# Altium project LCD_Dev_PCB_Project.PrjPcb
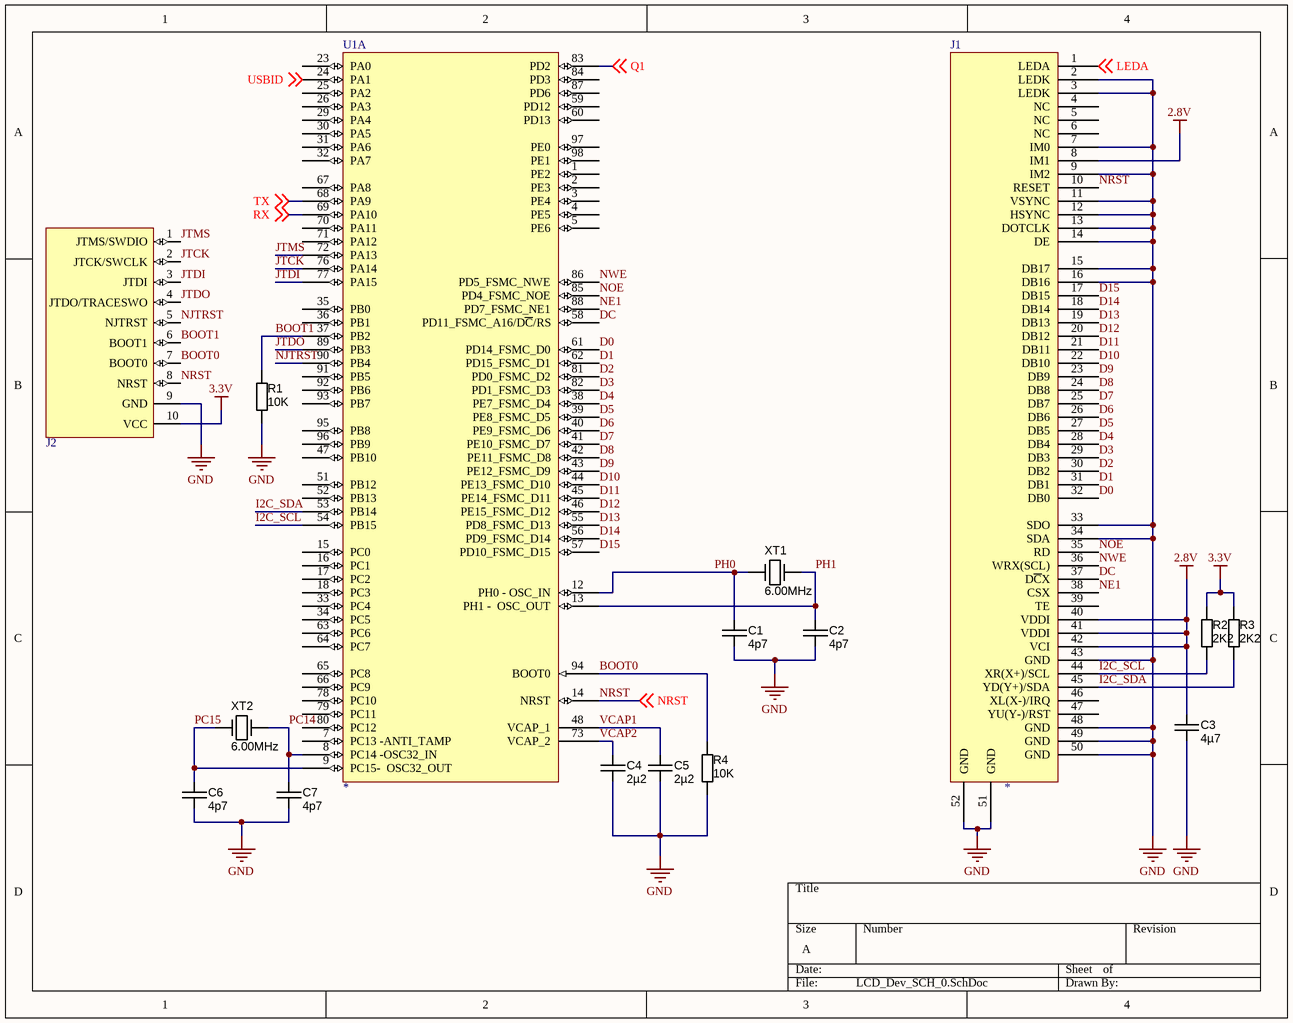
[diagram p0: LCD_Dev_SCH_0.SchDoc]
2 sheets, 60 parts. Net scope: global (net labels, ports and power ports of the same name join across sheets).
Board files: LCD_Dev_PCB.PcbDoc, LCD_Dev_PCB1.PcbDoc
Sheets:
  LCD_Dev_SCH_0.SchDoc
  LCD_Dev_SCH_1.SchDoc

## Sheet LCD_Dev_SCH_0.SchDoc
size A

### Parts
C1  value 4p7  [CAPC1608X90N]  (hidden comment: approved sub OK)
C2  value 4p7  [CAPC1608X90N]  (hidden comment: approved sub OK)
C3  value 4µ7  [CAPC2012X135N]  (hidden comment: approved sub OK)
C4  value 2µ2  [CAPC2012X135N]  (hidden comment: approved sub OK)
C5  value 2µ2  [CAPC2012X135N]  (hidden comment: approved sub OK)
C6  value 4p7  [CAPC1608X90N]  (hidden comment: approved sub OK)
C7  value 4p7  [CAPC1608X90N]  (hidden comment: approved sub OK)
J1  *  [ER-CON50HT-1]
J2  *  [SWJ-DP connector]  (value not drawn)
R1  value 10K  [RESC1608X55N]  (hidden comment: Thick Film)
R2  value 2K2  [RESC1608X55N]  (hidden comment: Thick Film)
R3  value 2K2  [RESC1608X55N]  (hidden comment: Thick Film)
R4  value 10K  [RESC1608X55N]  (hidden comment: Thick Film)
U1  *  [LQFP100_STM32F4]  (part A of 2)
XT1  6.00MHz  [CRYSTAL_HC49-US-SM]
XT2  6.00MHz  [CRYSTAL_HC49-US-SM]

### Nets
2.8V: C3.1 J1.8(IM1) J1.40(VDDI) J1.41(VDDI) J1.42(VCI)
3.3V: J2.10(VCC) R2.1 R3.1
GND: C1.2 C2.2 C3.2 C4.2 C5.2 C6.2 C7.2 J1.2(LEDK) J1.3(LEDK) J1.7(IM0) J1.9(IM2) J1.11(VSYNC) J1.12(HSYNC) J1.13(DOTCLK) J1.14(DE) J1.15(DB17) J1.16(DB16) J1.33(SDO) J1.34(SDA) J1.43(GND) J1.48(GND) J1.49(GND) J1.50(GND) J1.51(GND) J1.52(GND) J2.9(GND) R1.2 R4.2
BOOT0: J2.7(BOOT0) R4.1 U1.94(BOOT0)
BOOT1: J2.6(BOOT1) R1.1 U1.37(PB2)
D0: J1.32(DB0) U1.61(PD14_FSMC_D0)
D1: J1.31(DB1) U1.62(PD15_FSMC_D1)
D2: J1.30(DB2) U1.81(PD0_FSMC_D2)
D3: J1.29(DB3) U1.82(PD1_FSMC_D3)
D4: J1.28(DB4) U1.38(PE7_FSMC_D4)
D5: J1.27(DB5) U1.39(PE8_FSMC_D5)
D6: J1.26(DB6) U1.40(PE9_FSMC_D6)
D7: J1.25(DB7) U1.41(PE10_FSMC_D7)
D8: J1.24(DB8) U1.42(PE11_FSMC_D8)
D9: J1.23(DB9) U1.43(PE12_FSMC_D9)
D10: J1.22(DB10) U1.44(PE13_FSMC_D10)
D11: J1.21(DB11) U1.45(PE14_FSMC_D11)
D12: J1.20(DB12) U1.46(PE15_FSMC_D12)
D13: J1.19(DB13) U1.55(PD8_FSMC_D13)
D14: J1.18(DB14) U1.56(PD9_FSMC_D14)
D15: J1.17(DB15) U1.57(PD10_FSMC_D15)
DC: J1.37(D~{C}X) U1.58(PD11_FSMC_A16/D~{C}/RS)
I2C_SCL: J1.44(XR(X+)/SCL) R2.2 U1.54(PB15)
I2C_SDA: J1.45(YD(Y+)/SDA) R3.2 U1.53(PB14)
JTCK: J2.2(JTCK/SWCLK) U1.76(PA14)
JTDI: J2.3(JTDI) U1.77(PA15)
JTDO: J2.4(JTDO/TRACESWO) U1.89(PB3)
JTMS: J2.1(JTMS/SWDIO) U1.72(PA13)
LEDA: J1.1(LEDA) ; off-sheet LEDA
NE1: J1.38(CSX) U1.88(PD7_FSMC_NE1)
NJTRST: J2.5(NJTRST) U1.90(PB4)
NOE: J1.35(RD) U1.85(PD4_FSMC_NOE)
NRST: J1.10(RESET) J2.8(NRST) U1.14(NRST) ; off-sheet NRST
NWE: J1.36(WRX(SCL)) U1.86(PD5_FSMC_NWE)
PC14: C7.1 U1.8(PC14_-OSC32_IN) XT2.2(OUT)
PC15: C6.1 U1.9(PC15-__OSC32_OUT) XT2.1(IN)
PH0: C1.1 U1.12(PH0_-_OSC_IN) XT1.1(IN)
PH1: C2.1 U1.13(PH1_-__OSC_OUT) XT1.2(OUT)
Q1: U1.83(PD2) ; off-sheet Q1
RX: U1.69(PA10) ; off-sheet RX
TX: U1.68(PA9) ; off-sheet TX
USBID: U1.24(PA1) ; off-sheet USBID
VCAP1: C5.1 U1.48(VCAP_1)
VCAP2: C4.1 U1.73(VCAP_2)

Not connected (* = marked no-connect by the designer): J1 4(NC) 5(NC) 6(NC) 39(TE) 46(XL(X-)/IRQ) 47(YU(Y-)/RST); U1 1(PE2) 2(PE3) 3(PE4) 4(PE5) 5(PE6) 7(PC13_-ANTI_TAMP) 15(PC0) 16(PC1) 17(PC2) 18(PC3) 23(PA0) 25(PA2) 26(PA3) 29(PA4) 30(PA5) 31(PA6) 32(PA7) 33(PC4) 34(PC5) 35(PB0) 36(PB1) 47(PB10) 51(PB12) 52(PB13) 59(PD12) 60(PD13) 63(PC6) 64(PC7) 65(PC8) 66(PC9) 67(PA8) 70(PA11) 71(PA12) 78(PC10) 79(PC11) 80(PC12) 84(PD3) 87(PD6) 91(PB5) 92(PB6) 93(PB7) 95(PB8) 96(PB9) 97(PE0) 98(PE1)

### Library data of the parts
C1 C2 C6 C7 = CAPC_4p7_100V_0603: Capacitor SMD Cer 4.7pF ±0.25pF 100V NP0 0603; Manufacturer 1: AVX Corporation; Manufacturer Part Number 1: 06031A4R7CAT2A; Ratings: 100V; NP0; SCDType: source*; Tolerance: ±0.25pF; Operating Temperature: -55°C ~ 125°C; Package / Case: 0603 (1608 metric); Supplier 1: Digi-Key; Supplier Part Number 1: 478-4992-1-ND
C3 = CAPC_4u7_0805: Capacitor SMD Cer 4.7uF 10% 16V X5R 0805; Manufacturer 1: Taiyo Yuden; Manufacturer Part Number 1: EMK212BJ475KG-T; Ratings: 16V; X5R; Material: ceramic; SCDType: spec; Package / Case: 0805 (2012 Metric); Tolerance: ±10%; Supplier 1: Digi-Key; Supplier Part Number 1: 587-1294-1-ND; Operating Temperature: -55°C ~ 85°C; Size / Dimension: 0.079" L x 0.049" W (2.00mm x 1.25mm); Thickness (Max): 0.053" (1.35mm); ComponentLink1URL: http://www.yuden.co.jp/productdata/catalog/en/mlcc01_e.pdf; ComponentLink1Description: http://www.yuden.co.jp/productdata/catalog/en/mlcc01_e.pdf; Supplier 2: Digi-Key; Supplier Part Number 2: 1276-1065-1-ND; Manufacturer 2: Samsung Electro-Mechanics America, Inc; Manufacturer Part Number 2: CL21A475KOFNNNE; RoHS 2: RoHS Compliant; ComponentLink2URL: http://www.samsungsem.com/servlet/FileDownload?type=spec&file=CL21A475KOFNNNE.pdf; ComponentLink2Description: http://www.samsungsem.com/servlet/FileDownload?type=spec&file=CL21A475KOFNNNE.pdf; Supplier 3: Digi-Key; Supplier Part Number 3: 399-8101-1-ND; Manufacturer 3: Kemet; Manufacturer Part Number 3: C0805C475K4PACTU; RoHS 3: RoHS Compliant; ComponentLink3URL: http://capacitoredge.kemet.com/capedge2/DataSheet?pn=C0805C475K4PACTU; ComponentLink3Description: http://capacitoredge.kemet.com/capedge2/DataSheet?pn=C0805C475K4PACTU; Supplier 4: Digi-Key; Supplier Part Number 4: 490-7215-1-ND; Manufacturer 4: Murata Electronics North America; Manufacturer Part Number 4: GRM21BR61C475MA88L; RoHS 4: RoHS Compliant; ComponentLink4URL: http://psearch.murata.com/capacitor/product/GRM21BR61C475MA88#.pdf; ComponentLink4Description: http://psearch.murata.com/capacitor/product/GRM21BR61C475MA88#.pdf; Supplier 5: Digi-Key; Supplier Part Number 5: 445-7640-1-ND; Manufacturer 5: TDK Corporation; Manufacturer Part Number 5: C2012X5R1C475K125AC; RoHS 5: RoHS Compliant; ComponentLink5URL: http://product.tdk.com/capacitor/mlcc/en/documents/mlcc_commercial_general_en.pdf; ComponentLink5Description: http://product.tdk.com/capacitor/mlcc/en/documents/mlcc_commercial_general_en.pdf; RoHS 1: RoHS Compliant
C4 C5 = CAPC_2u2_0805: Capacitor SMD Cer 2.2uF 10% 16V X7R 0805; Manufacturer 1: Kemet; Manufacturer Part Number 1: C0805C225K4RACTU; Ratings: 16V; X7R; SCDType: undef; Package / Case: 0805 (2012 metric); Tolerance: ±10%; Supplier 1: Digi-Key; Supplier Part Number 1: 399-3523-1-ND
J1 = LCD-Port: 3.5”TFT LCD Display Port (i80/6800/FSMC etc)
J2 = SWJ-Debug Port: 10 pin Serial Wire JTAG Debug Port
R1 R4 = RES_10K_0603_5%: Resistor SMD chip 10k Ohm 0.1W 5% 0603; Manufacturer 1: Yageo; Manufacturer Part Number 1: RC0603JR-0710KL; Ratings: 1/10 W; SCDType: spec; Package / Case: 0603 (1608 metric); Tolerance: ±5%; Manufacturer 2: Vishay Dale; Manufacturer Part Number 2: CRCW060310K0JNEA; Supplier 1: Digi-Key; Supplier Part Number 1: 311-10KGRCT-ND; ComponentLink1URL: http://www.yageo.com/documents/recent/PYu-RC0603_51_RoHS_L_4.pdf; ComponentLink1Description: http://www.yageo.com/documents/recent/PYu-RC0603_51_RoHS_L_4.pdf; Supplier 2: Digi-Key; Supplier Part Number 2: 541-10KGCT-ND; ComponentLink2URL: http://www.vishay.com/doc?20035; ComponentLink2Description: http://www.vishay.com/doc?20035; Material: Thick Film
R2 R3 = RES_2K2_0603_5%: Resistor SMD chip 2.2k Ohm 0.1W 5% 0603; Manufacturer 1: Yageo; Manufacturer Part Number 1: RC0603JR-072K2L; Ratings: 1/10 W; SCDType: spec; Temperature Coefficient: ±100ppm/°C; Package / Case: 0603 (1608 metric); Tolerance: ±5%; Material: Thick Film; Manufacturer 2: Samsung Electro-Mechanics America, Inc; Manufacturer Part Number 2: RC1608J222CS; Supplier 1: Digi-Key; Supplier Part Number 1: 311-2.2KGRDKR-ND; ComponentLink1URL: http://www.yageo.com/documents/recent/PYu-RC0603_51_RoHS_L_4.pdf; ComponentLink1Description: http://www.yageo.com/documents/recent/PYu-RC0603_51_RoHS_L_4.pdf; Supplier 2: Digi-Key; Supplier Part Number 2: 1276-5070-6-ND; ComponentLink2URL: http://www.samsungsem.com/servlet/FileDownload?filename=productcatalog/pdf/Chip_Resistor.pdf; ComponentLink2Description: http://www.samsungsem.com/servlet/FileDownload?filename=productcatalog/pdf/Chip_Resistor.pdf; RoHS 1: RoHS Compliant; RoHS 2: RoHS Compliant; Supplier 3: Digi-Key; Supplier Part Number 3: RMCF0603JT2K20DKR-ND; Manufacturer 3: Stackpole Electronics Inc; Manufacturer Part Number 3: RMCF0603JT2K20; RoHS 3: RoHS Compliant; ComponentLink3URL: http://www.seielect.com/Catalog/SEI-RMCF_RMCP.pdf; ComponentLink3Description: http://www.seielect.com/Catalog/SEI-RMCF_RMCP.pdf; Supplier 4: Digi-Key; Supplier Part Number 4: RHM2.2KCGDKR-ND; Manufacturer 4: Rohm Semiconductor; Manufacturer Part Number 4: MCR03ERTJ222; RoHS 4: RoHS Compliant; ComponentLink4URL: http://rohmfs.rohm.com/en/products/databook/datasheet/passive/resistor/chip_resistor/mcr_g.pdf; ComponentLink4Description: http://rohmfs.rohm.com/en/products/databook/datasheet/passive/resistor/chip_resistor/mcr_g.pdf; Supplier 5: Digi-Key; Supplier Part Number 5: P2.2KGDKR-ND; Manufacturer 5: Panasonic Electronic Components; Manufacturer Part Number 5: ERJ-3GEYJ222V; RoHS 5: RoHS Compliant; ComponentLink5URL: http://industrial.panasonic.com/www-cgi/jvcr13pz.cgi?E+PZ+3+AOA0001+ERJ3GEYJ222V+7+WW; ComponentLink5Description: http://industrial.panasonic.com/www-cgi/jvcr13pz.cgi?E+PZ+3+AOA0001+ERJ3GEYJ222V+7+WW
U1 = STM32F413xH: STM32F413VHT symbol for FSMC application with designated FSMC relevant pins
XT1 XT2 = Crystal_6MHz_HC49/US: Resonator Ceramic 6.00 MHz 30ppm; Manufacturer 1: CTS-Frequency Controls; Manufacturer Part Number 1: ATS060BSM-1; Frequency: 6MHz; Frequency Stability: ±50ppm; Load Capacitance: 18pF; Operating Mode: Fundamental; Parameter Name: 0.169" (4.30mm); SCDType: spec; Package / Case: HC49/US-SM; Ratings: 6.00 MHz; Supplier 1: Digi-Key; Supplier Part Number 1: CTX882CT-ND; Type: MHz Crystal; Frequency Tolerance: ±30ppm; Operating Temperature: -20°C ~ 70°C; Mounting Type: Surface Mount; Size / Dimension: 0.437" L x 0.190" W (11.10mm x 4.83mm); ComponentLink1URL: http://www.ctscorp.com/components/Datasheets/008-0309-0.pdf; ComponentLink1Description: http://www.ctscorp.com/components/Datasheets/008-0309-0.pdf

## Sheet LCD_Dev_SCH_1.SchDoc
size A
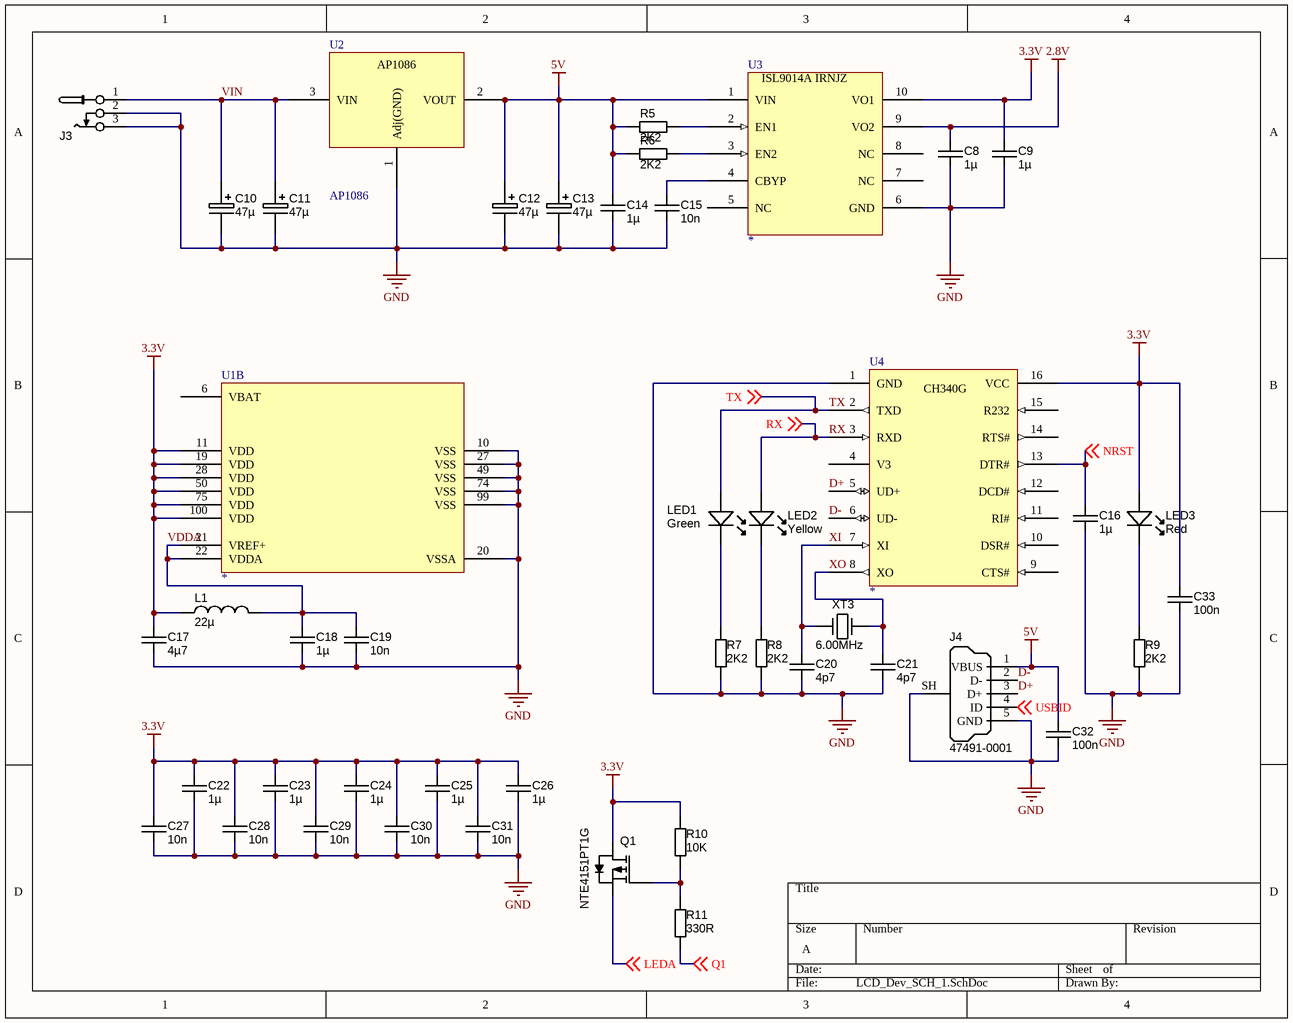
[diagram p1: LCD_Dev_SCH_1.SchDoc]

### Parts
C8  value 1µ  [CAPC2012X135N]  (hidden comment: approved sub OK)
C9  value 1µ  [CAPC2012X135N]  (hidden comment: approved sub OK)
C10  47µ  [CAPMP6032X280N]
C11  47µ  [CAPMP6032X280N]
C12  47µ  [CAPMP6032X280N]
C13  47µ  [CAPMP6032X280N]
C14  value 1µ  [CAPC2012X135N]  (hidden comment: approved sub OK)
C15  value 10n  [CAPC1608X90N]  (hidden comment: approved sub OK)
C16  value 1µ  [CAPC2012X135N]  (hidden comment: approved sub OK)
C17  value 4µ7  [CAPC2012X135N]  (hidden comment: approved sub OK)
C18  value 1µ  [CAPC2012X135N]  (hidden comment: approved sub OK)
C19  value 10n  [CAPC1608X90N]  (hidden comment: approved sub OK)
C20  value 4p7  [CAPC1608X90N]  (hidden comment: approved sub OK)
C21  value 4p7  [CAPC1608X90N]  (hidden comment: approved sub OK)
C22  value 1µ  [CAPC2012X135N]  (hidden comment: approved sub OK)
C23  value 1µ  [CAPC2012X135N]  (hidden comment: approved sub OK)
C24  value 1µ  [CAPC2012X135N]  (hidden comment: approved sub OK)
C25  value 1µ  [CAPC2012X135N]  (hidden comment: approved sub OK)
C26  value 1µ  [CAPC2012X135N]  (hidden comment: approved sub OK)
C27  value 10n  [CAPC1608X90N]  (hidden comment: approved sub OK)
C28  value 10n  [CAPC1608X90N]  (hidden comment: approved sub OK)
C29  value 10n  [CAPC1608X90N]  (hidden comment: approved sub OK)
C30  value 10n  [CAPC1608X90N]  (hidden comment: approved sub OK)
C31  value 10n  [CAPC1608X90N]  (hidden comment: approved sub OK)
C32  value 100n  [CAPC1608X90N]  (hidden comment: approved sub OK)
C33  value 100n  [CAPC1608X90N]  (hidden comment: approved sub OK)
J3  *  [CONN_PWR_JACK_0.7x2.35mm]  (value not drawn)
J4  Manufacturer Part Number 1: 47491-0001  [USB_Micro-B_Molex_SMD]  (hidden comment: USB Micro Type B)
L1  value 22µ  [INDM3225X240N]  (hidden comment: SMD-322522)
LED1  Green  [LED-0603-GREEN]
LED2  Yellow  [LED-0603-YELLOW]
LED3  Red  [LED-0603-RED]
Q1  Manufacturer Part Number 1: NTE4151PT1G  [SOT523F]  (hidden comment: P-Channel)
R5  value 2K2  [RESC1608X55N]  (hidden comment: Thick Film)
R6  value 2K2  [RESC1608X55N]  (hidden comment: Thick Film)
R7  value 2K2  [RESC1608X55N]  (hidden comment: Thick Film)
R8  value 2K2  [RESC1608X55N]  (hidden comment: Thick Film)
R9  value 2K2  [RESC1608X55N]  (hidden comment: Thick Film)
R10  value 10K  [RESC1608X55N]  (hidden comment: Thick Film)
R11  value 330R  [RESC1608X55N]  (hidden comment: Thick Film)
U1  *  [LQFP100_STM32F4]  (part B of 2)
U2  AP1086  [TO263-3L]
U3  *  [10LD3X3DFN]
U4  *  [SOP16]
XT3  6.00MHz  [CRYSTAL_HC49-US-SM]

### Nets
2.8V: C8.1 U3.9(VO2)
3.3V: C9.1 C17.1 C22.1 C23.1 C24.1 C25.1 C26.1 C27.1 C28.1 C29.1 C30.1 C31.1 C33.1 L1.1 LED3.A Q1.3(D) R10.1 U1.11(VDD) U1.19(VDD) U1.28(VDD) U1.50(VDD) U1.75(VDD) U1.100(VDD) U3.10(VO1) U4.16(VCC)
5V: C12.1 C13.1 C14.1 C32.1 J4.1(VBUS) R5.1 R6.1 U2.2(VOUT) U3.1(VIN)
GND: C8.2 C9.2 C10.2 C11.2 C12.2 C13.2 C14.2 C15.2 C16.2 C17.2 C18.2 C19.2 C20.2 C21.2 C22.2 C23.2 C24.2 C25.2 C26.2 C27.2 C28.2 C29.2 C30.2 C31.2 C32.2 C33.2 J3.2(NC) J3.3(NEG) J4.5(GND) J4.SH(Shell) R7.2 R8.2 R9.2 U1.10(VSS) U1.20(VSSA) U1.27(VSS) U1.49(VSS) U1.74(VSS) U1.99(VSS) U2.1(Adj(GND)) U3.6(GND) U4.1(GND)
D+: J4.3(D+) U4.5(UD+)
D-: J4.2(D-) U4.6(UD-)
LEDA: Q1.2(S) ; off-sheet LEDA
NRST: C16.1 U4.13(DTR#) ; off-sheet NRST
Q1: R11.2 ; off-sheet Q1
RX: LED2.A U4.3(RXD) ; off-sheet RX
TX: LED1.A U4.2(TXD) ; off-sheet TX
USBID: J4.4(ID) ; off-sheet USBID
VDDA: C18.1 C19.1 L1.2 U1.21(VREF+) U1.22(VDDA)
VIN: C10.1 C11.1 J3.1(POS) U2.3(VIN)
XI: C20.1 U4.7(XI) XT3.1(IN)
XO: C21.1 U4.8(XO) XT3.2(OUT)
NetC15_1: C15.1 U3.4(CBYP)
NetLED1_K: LED1.K R7.1
NetLED2_K: LED2.K R8.1
NetLED3_K: LED3.K R9.1
NetQ1_1: Q1.1(G) R10.2 R11.1
NetR5_2: R5.2 U3.2(EN1)
NetR6_2: R6.2 U3.3(EN2)

Not connected (* = marked no-connect by the designer): U1 6(VBAT); U3 5(NC) 7(NC) 8(NC); U4 4(V3) 9(CTS#) 10(DSR#) 11(RI#) 12(DCD#) 14(RTS#) 15(R232)

### Notes on the sheet
- (in symbol ISL9014A_IRNJZ) ISL9014A IRNJZ

### Library data of the parts
C8 C9 C14 C16 C18 = CAPC_1u_0805_X7R_16V_10%: Capacitor SMD Cer 1uF 10% 16V X7R 0805; Manufacturer 1: Yageo; Manufacturer Part Number 1: CC0805KKX7R7BB105; Ratings: 16V; X7R; SCDType: spec; Material: ceramic; Tolerance: ±10%; Package / Case: 0805 (2012 metric); Supplier 1: Digi-Key; Supplier Part Number 1: 311-1365-6-ND; RoHS 1: RoHS Compliant; ComponentLink1URL: http://www.yageo.com/documents/recent/UPY-GPHC_X7R_6.3V-to-50V_8.pdf; ComponentLink1Description: http://www.yageo.com/documents/recent/UPY-GPHC_X7R_6.3V-to-50V_8.pdf; Supplier 2: Digi-Key; Supplier Part Number 2: 399-1284-6-ND; Manufacturer 2: Kemet; Manufacturer Part Number 2: C0805C105K4RACTU; RoHS 2: RoHS Compliant; ComponentLink2URL: http://www.kemet.com/datasheets&C0805C105K4RACTU; ComponentLink2Description: http://www.kemet.com/datasheets&C0805C105K4RACTU; Supplier 3: Digi-Key; Supplier Part Number 3: 1276-1026-6-ND; Manufacturer 3: Samsung Electro-Mechanics America, Inc; Manufacturer Part Number 3: CL21B105KOFNNNE; RoHS 3: RoHS Compliant; ComponentLink3URL: http://www.samsungsem.com/servlet/FileDownload?type=spec&file=CL21B105KOFNNNE.pdf; ComponentLink3Description: http://www.samsungsem.com/servlet/FileDownload?type=spec&file=CL21B105KOFNNNE.pdf; Supplier 4: Digi-Key; Supplier Part Number 4: 445-1358-6-ND; Manufacturer 4: TDK Corporation; Manufacturer Part Number 4: C2012X7R1C105K125AA; RoHS 4: RoHS Compliant; ComponentLink4URL: http://product.tdk.com/capacitor/mlcc/en/documents/mlcc_commercial_general_en.pdf; ComponentLink4Description: http://product.tdk.com/capacitor/mlcc/en/documents/mlcc_commercial_general_en.pdf; Temperature Coefficient: X7R
C10-C13 = CAPT_47u_6032_16V: Capacitor SMD Tantalum 47uF 10% 16V 6032-28; Manufacturer 1: Vishay/Sprague; Manufacturer Part Number 1: TR3C476K016C0300; SCDType: undef; Package / Case: EIA 535BAAC size C; Ratings: 16V; Tolerance: ±10%; Material: Tantalum; Supplier 1: Digi-Key; Supplier Part Number 1: 718-1332-1-ND; Value: 47µ
C15 C19 C27-C31 = CAPC_10n_0603_X7R_50V_10%: Capacitor SMD Cer 10nF 10% 50V X7R 0603; Manufacturer 1: TDK Corporation; Manufacturer Part Number 1: C1608X7R1H103K; Ratings: 50V; X7R; SCDType: spec; Material: ceramic; Tolerance: ±10%; Package / Case: 0603 (1608 metric); Manufacturer 2: AVX Corporation; Manufacturer Part Number 2: 06035C103KAT2A; Supplier 1: Digi-Key; Supplier Part Number 1: 445-1311-1-ND; ComponentLink1URL: http://product.tdk.com/capacitor/mlcc/en/documents/mlcc_commercial_general_en.pdf; ComponentLink1Description: http://product.tdk.com/capacitor/mlcc/en/documents/mlcc_commercial_general_en.pdf; Supplier 2: Digi-Key; Supplier Part Number 2: 478-1227-1-ND; ComponentLink2URL: http://www.avx.com/docs/Catalogs/cx7r.pdf; ComponentLink2Description: http://www.avx.com/docs/Catalogs/cx7r.pdf
C17 = CAPC_4u7_0805: as C3 on sheet LCD_Dev_SCH_0; Package / Case: 0805 (2012 Metric); Tolerance: ±10%; Supplier 1: Digi-Key; Supplier Part Number 1: 587-1294-1-ND; Operating Temperature: -55°C ~ 85°C; Size / Dimension: 0.079" L x 0.049" W (2.00mm x 1.25mm); Thickness (Max): 0.053" (1.35mm); ComponentLink1URL: http://www.yuden.co.jp/productdata/catalog/en/mlcc01_e.pdf; ComponentLink1Description: http://www.yuden.co.jp/productdata/catalog/en/mlcc01_e.pdf; Supplier 2: Digi-Key; Supplier Part Number 2: 1276-1065-1-ND; Manufacturer 2: Samsung Electro-Mechanics America, Inc; Manufacturer Part Number 2: CL21A475KOFNNNE; RoHS 2: RoHS Compliant; ComponentLink2URL: http://www.samsungsem.com/servlet/FileDownload?type=spec&file=CL21A475KOFNNNE.pdf; ComponentLink2Description: http://www.samsungsem.com/servlet/FileDownload?type=spec&file=CL21A475KOFNNNE.pdf; Supplier 3: Digi-Key; Supplier Part Number 3: 399-8101-1-ND; Manufacturer 3: Kemet; Manufacturer Part Number 3: C0805C475K4PACTU; RoHS 3: RoHS Compliant; ComponentLink3URL: http://capacitoredge.kemet.com/capedge2/DataSheet?pn=C0805C475K4PACTU; ComponentLink3Description: http://capacitoredge.kemet.com/capedge2/DataSheet?pn=C0805C475K4PACTU; Supplier 4: Digi-Key; Supplier Part Number 4: 490-7215-1-ND; Manufacturer 4: Murata Electronics North America; Manufacturer Part Number 4: GRM21BR61C475MA88L; RoHS 4: RoHS Compliant; ComponentLink4URL: http://psearch.murata.com/capacitor/product/GRM21BR61C475MA88#.pdf; ComponentLink4Description: http://psearch.murata.com/capacitor/product/GRM21BR61C475MA88#.pdf; Supplier 5: Digi-Key; Supplier Part Number 5: 445-7640-1-ND; Manufacturer 5: TDK Corporation; Manufacturer Part Number 5: C2012X5R1C475K125AC; RoHS 5: RoHS Compliant; ComponentLink5URL: http://product.tdk.com/capacitor/mlcc/en/documents/mlcc_commercial_general_en.pdf; ComponentLink5Description: http://product.tdk.com/capacitor/mlcc/en/documents/mlcc_commercial_general_en.pdf; RoHS 1: RoHS Compliant
C20 C21 = CAPC_4p7_100V_0603: as C1 on sheet LCD_Dev_SCH_0; Tolerance: ±0.25pF; Operating Temperature: -55°C ~ 125°C; Package / Case: 0603 (1608 metric); Supplier 1: Digi-Key; Supplier Part Number 1: 478-4992-1-ND
C22-C26 = CAPC_1u_0805_X7R_16V_10%: Capacitor SMD Cer 1uF 10% 16V X7R 0805; Manufacturer 1: Yageo; Manufacturer Part Number 1: CC0805KKX7R7BB105; Ratings: 16V; X7R; Material: ceramic; SCDType: spec; Package / Case: 0805 (2012 metric); Tolerance: ±10%; Supplier 1: Digi-Key; Supplier Part Number 1: 311-1365-6-ND; ComponentLink1URL: http://www.yageo.com/documents/recent/UPY-GPHC_X7R_6.3V-to-50V_8.pdf; ComponentLink1Description: http://www.yageo.com/documents/recent/UPY-GPHC_X7R_6.3V-to-50V_8.pdf; RoHS 1: RoHS Compliant; Temperature Coefficient: X7R; Supplier 2: Digi-Key; Supplier Part Number 2: 399-1284-6-ND; Manufacturer 2: Kemet; Manufacturer Part Number 2: C0805C105K4RACTU; RoHS 2: RoHS Compliant; ComponentLink2URL: http://www.kemet.com/datasheets&C0805C105K4RACTU; ComponentLink2Description: http://www.kemet.com/datasheets&C0805C105K4RACTU; Supplier 3: Digi-Key; Supplier Part Number 3: 1276-1026-6-ND; Manufacturer 3: Samsung Electro-Mechanics America, Inc; Manufacturer Part Number 3: CL21B105KOFNNNE; RoHS 3: RoHS Compliant; ComponentLink3URL: http://www.samsungsem.com/servlet/FileDownload?type=spec&file=CL21B105KOFNNNE.pdf; ComponentLink3Description: http://www.samsungsem.com/servlet/FileDownload?type=spec&file=CL21B105KOFNNNE.pdf; Supplier 4: Digi-Key; Supplier Part Number 4: 445-1358-6-ND; Manufacturer 4: TDK Corporation; Manufacturer Part Number 4: C2012X7R1C105K125AA; RoHS 4: RoHS Compliant; ComponentLink4URL: http://product.tdk.com/capacitor/mlcc/en/documents/mlcc_commercial_general_en.pdf; ComponentLink4Description: http://product.tdk.com/capacitor/mlcc/en/documents/mlcc_commercial_general_en.pdf
C32 C33 = CAPC_100n_0603_X7R_50V_10%: Capacitor SMD Cer 100nF 10% 50V X7R 0603; Manufacturer 1: AVX Corporation; Manufacturer Part Number 1: 06035C104KAT2A; Ratings: 50V; X7R; SCDType: spec; Material: ceramic; Tolerance: ±10%; Package / Case: 0603 (1608 Metric); Supplier 1: Digi-Key; Supplier Part Number 1: 478-5052-1-ND; ComponentLink1URL: http://www.avx.com/docs/Catalogs/cx7r.pdf; ComponentLink1Description: http://www.avx.com/docs/Catalogs/cx7r.pdf; Supplier 2: Digi-Key; Supplier Part Number 2: 445-1314-1-ND; Manufacturer 2: TDK Corporation; Manufacturer Part Number 2: C1608X7R1H104K; ComponentLink2URL: http://product.tdk.com/capacitor/mlcc/en/documents/mlcc_commercial_general_en.pdf; ComponentLink2Description: http://product.tdk.com/capacitor/mlcc/en/documents/mlcc_commercial_general_en.pdf
J3 = CONN_PWR_JACK_0.7x2.35mm: Connector Power THT 0.7mm ID x 2.35mm OD; Manufacturer 1: Kobiconn; Manufacturer Part Number 1: 163-4307-E; Value: 0.7mm ID, 2.35mm OD; SCDType: undef; Category: Connectors; Mounting Type: Through Hole; Package / Case: PCB mount; HELPURL: http://www.mouser.com/ProductDetail/Kobiconn/163-4307-E/?qs=FrCfMICDGNKiKC02lNlE3g%3D%3D
J4 = USB_Micro_TypeB: Connector SMD USB Micro Type B middle mount; Manufacturer 1: Molex Inc; SCDType: undef; Package / Case: SMD; Supplier 1: Digi-Key; Supplier Part Number 1: WM17142CT-ND
L1 = INDC_22u_1210_110mA: Inductor 22uH 110mA 1210 SMD chip; Manufacturer 1: 3L; Manufacturer Part Number 1: SMD-322522-220K; Ratings: 110 mAdc; Tolerance: ±10%; Type: Ferrite Core; DC Resistance (DCR): 3.7 Ohm; Q @ Freq: 30 @ 2.52MHz; Frequency - Self Resonant: 20MHz; Frequency - Test: 2.52MHz; SCDType: source; Package / Case: 1210 (3225 Metric); Operating Temperature: -20°C ~ 80°C; Supplier 1: APlus Products; Supplier Part Number 1: SMD-322522-220K
LED1 = LED_SMD_Green_0603_570nm: LED 0603 SMD Green 570nm 50mcd 20mA; Manufacturer 1: Kingbright Company LLC; Manufacturer Part Number 1: APT1608CGCK; Material: AlGaInP; Ratings: 20mcd min; 50 mcd typ; 570 nm; Voltage - Forward (Vf) Typ: 2.1V; Viewing Angle: 120°; Lens Style/Size: Rectangle with Flat Top, 1.1mm x 0.8mm; Voltage - Forward (Vf) @ 10mA: 2.0V; SCDType: source; Wavelength - Peak: 574nm; Lens Type: Clear; Package / Case: 0603 (1608 metric); Color: Green; Current - Test: 20mA; Supplier 1: Digi-Key; Supplier Part Number 1: 754-1116-1-ND; RoHS 1: RoHS Compliant; Wavelength - Dominant: 570nm; ComponentLink1URL: http://www.us.kingbright.com/images/catalog/SPEC/APT1608CGCK.pdf; ComponentLink1Description: http://www.us.kingbright.com/images/catalog/SPEC/APT1608CGCK.pdf
LED2 = LED_SMD_Yellow_0603_150mcd: LED 0603 SMD Yellow 590nm 150mcd 20mA; Manufacturer 1: Kingbright Company LLC; Manufacturer Part Number 1: APT1608SYCK; Material: AlGaInP on GaAs; Ratings: 150 mcd; 590 nm; Voltage - Forward (Vf) Typ: 2V; Voltage - Forward (Vf) @ 10mA: 1.95V; SCDType: source; Package / Case: 0603 (1608 metric); Supplier 1: Digi-Key; Supplier Part Number 1: 754-1124-1-ND; ComponentLink1URL: http://www.us.kingbright.com/images/catalog/SPEC/APT1608SYCK.pdf; ComponentLink1Description: http://www.us.kingbright.com/images/catalog/SPEC/APT1608SYCK.pdf
LED3 = LED_SMD_Red_0603_220mcd: LED 0603 SMD Hyper Red 630nm 220mcd 20mA; Manufacturer 1: Kingbright Company LLC; Manufacturer Part Number 1: APT1608SURCK; Material: AlGaInP on GaAs; Ratings: 220 mcd; 630 nm; Voltage - Forward (Vf) Typ: 1.95V; Voltage - Forward (Vf) @ 10mA: 1.9V; SCDType: source; Package / Case: 0603 (1608 metric); Supplier 1: Digi-Key; Supplier Part Number 1: 754-1123-1-ND; ComponentLink1URL: http://www.us.kingbright.com/images/catalog/SPEC/APT1608SURCK.pdf; ComponentLink1Description: http://www.us.kingbright.com/images/catalog/SPEC/APT1608SURCK.pdf
Q1 = MOSFET_P-CH_NTE4151PT1G: MOSFET SMD P-CH 20V 0.76A 0.313W SOT523F; Manufacturer 1: ON Semiconductor; Rds On (Max) @ Id, Vgs: 360 mOhm @ 350mA, 4.5V; Ratings: 20V; 760mA; 313mW; SCDType: source; Value: P-Channel; Package / Case: SC-89, SOT523F; Supplier 1: Digi-Key; Supplier Part Number 1: NTE4151PT1GOSCT-ND; ComponentLink1URL: http://www.onsemi.com/pub_link/Collateral/NTA4151P-D.PDF; ComponentLink1Description: http://www.onsemi.com/pub_link/Collateral/NTA4151P-D.PDF
R5-R9 = RES_2K2_0603_5%: as R2 on sheet LCD_Dev_SCH_0; Package / Case: 0603 (1608 metric); Tolerance: ±5%; Material: Thick Film; Manufacturer 2: Samsung Electro-Mechanics America, Inc; Manufacturer Part Number 2: RC1608J222CS; Supplier 1: Digi-Key; Supplier Part Number 1: 311-2.2KGRDKR-ND; ComponentLink1URL: http://www.yageo.com/documents/recent/PYu-RC0603_51_RoHS_L_4.pdf; ComponentLink1Description: http://www.yageo.com/documents/recent/PYu-RC0603_51_RoHS_L_4.pdf; Supplier 2: Digi-Key; Supplier Part Number 2: 1276-5070-6-ND; ComponentLink2URL: http://www.samsungsem.com/servlet/FileDownload?filename=productcatalog/pdf/Chip_Resistor.pdf; ComponentLink2Description: http://www.samsungsem.com/servlet/FileDownload?filename=productcatalog/pdf/Chip_Resistor.pdf; RoHS 1: RoHS Compliant; RoHS 2: RoHS Compliant; Supplier 3: Digi-Key; Supplier Part Number 3: RMCF0603JT2K20DKR-ND; Manufacturer 3: Stackpole Electronics Inc; Manufacturer Part Number 3: RMCF0603JT2K20; RoHS 3: RoHS Compliant; ComponentLink3URL: http://www.seielect.com/Catalog/SEI-RMCF_RMCP.pdf; ComponentLink3Description: http://www.seielect.com/Catalog/SEI-RMCF_RMCP.pdf; Supplier 4: Digi-Key; Supplier Part Number 4: RHM2.2KCGDKR-ND; Manufacturer 4: Rohm Semiconductor; Manufacturer Part Number 4: MCR03ERTJ222; RoHS 4: RoHS Compliant; ComponentLink4URL: http://rohmfs.rohm.com/en/products/databook/datasheet/passive/resistor/chip_resistor/mcr_g.pdf; ComponentLink4Description: http://rohmfs.rohm.com/en/products/databook/datasheet/passive/resistor/chip_resistor/mcr_g.pdf; Supplier 5: Digi-Key; Supplier Part Number 5: P2.2KGDKR-ND; Manufacturer 5: Panasonic Electronic Components; Manufacturer Part Number 5: ERJ-3GEYJ222V; RoHS 5: RoHS Compliant; ComponentLink5URL: http://industrial.panasonic.com/www-cgi/jvcr13pz.cgi?E+PZ+3+AOA0001+ERJ3GEYJ222V+7+WW; ComponentLink5Description: http://industrial.panasonic.com/www-cgi/jvcr13pz.cgi?E+PZ+3+AOA0001+ERJ3GEYJ222V+7+WW
R10 = RES_10K_0603_5%: as R1 on sheet LCD_Dev_SCH_0; Package / Case: 0603 (1608 metric); Tolerance: ±5%; Manufacturer 2: Vishay Dale; Manufacturer Part Number 2: CRCW060310K0JNEA; Supplier 1: Digi-Key; Supplier Part Number 1: 311-10KGRCT-ND; ComponentLink1URL: http://www.yageo.com/documents/recent/PYu-RC0603_51_RoHS_L_4.pdf; ComponentLink1Description: http://www.yageo.com/documents/recent/PYu-RC0603_51_RoHS_L_4.pdf; Supplier 2: Digi-Key; Supplier Part Number 2: 541-10KGCT-ND; ComponentLink2URL: http://www.vishay.com/doc?20035; ComponentLink2Description: http://www.vishay.com/doc?20035; Material: Thick Film
R11 = RES_330R_0603_5%: Resistor SMD chip 330 Ohm 0.1W 5% 0603; Manufacturer 1: Vishay Dale; Manufacturer Part Number 1: CRCW0603330RJNEA; Ratings: 1/10 W; SCDType: spec; Package / Case: 0603 (1608 metric); Tolerance: ±5%; Supplier 1: Digi-Key; Supplier Part Number 1: 541-330GCT-ND; ComponentLink1URL: http://www.vishay.com/doc?20035; ComponentLink1Description: http://www.vishay.com/doc?20035; Manufacturer 2: Yageo; Manufacturer Part Number 2: RC0603JR-07330RL; Material: Thick Film; Supplier 2: Digi-Key; Supplier Part Number 2: 311-330GRCT-ND; ComponentLink2URL: http://www.yageo.com/documents/recent/PYu-RC0603_51_RoHS_L_4.pdf; ComponentLink2Description: http://www.yageo.com/documents/recent/PYu-RC0603_51_RoHS_L_4.pdf
U1 = STM32F413xH: as U1 on sheet LCD_Dev_SCH_0
U3 = ISL9014A_IRNJZ: ISL9014A IRNJZ, Dual LDO, 3.3V and 2.8V, 300mA on both outputs
U4 = CH340G: USB bus conversion chip
XT3 = Crystal_6MHz_HC49/US: as XT1 on sheet LCD_Dev_SCH_0; Package / Case: HC49/US-SM; Ratings: 6.00 MHz; Supplier 1: Digi-Key; Supplier Part Number 1: CTX882CT-ND; Type: MHz Crystal; Frequency Tolerance: ±30ppm; Operating Temperature: -20°C ~ 70°C; Mounting Type: Surface Mount; Size / Dimension: 0.437" L x 0.190" W (11.10mm x 4.83mm); ComponentLink1URL: http://www.ctscorp.com/components/Datasheets/008-0309-0.pdf; ComponentLink1Description: http://www.ctscorp.com/components/Datasheets/008-0309-0.pdf

## Nets that join several sheets
2.8V: LCD_Dev_SCH_0 (5 pins), LCD_Dev_SCH_1 (C8.1 U3.9)
3.3V: LCD_Dev_SCH_0 (J2.10 R2.1 R3.1), LCD_Dev_SCH_1 (25 pins)
GND: LCD_Dev_SCH_0 (28 pins), LCD_Dev_SCH_1 (42 pins)
LEDA: LCD_Dev_SCH_0 (J1.1), LCD_Dev_SCH_1 (Q1.2)
NRST: LCD_Dev_SCH_0 (J1.10 J2.8 U1.14), LCD_Dev_SCH_1 (C16.1 U4.13)
Q1: LCD_Dev_SCH_0 (U1.83), LCD_Dev_SCH_1 (R11.2)
RX: LCD_Dev_SCH_0 (U1.69), LCD_Dev_SCH_1 (LED2.A U4.3)
TX: LCD_Dev_SCH_0 (U1.68), LCD_Dev_SCH_1 (LED1.A U4.2)
USBID: LCD_Dev_SCH_0 (U1.24), LCD_Dev_SCH_1 (J4.4)